# Altium schematic sheet Transceiver.SchDoc
size 209 x 297 mm; SheetNumber: 1; SheetTotal: 1
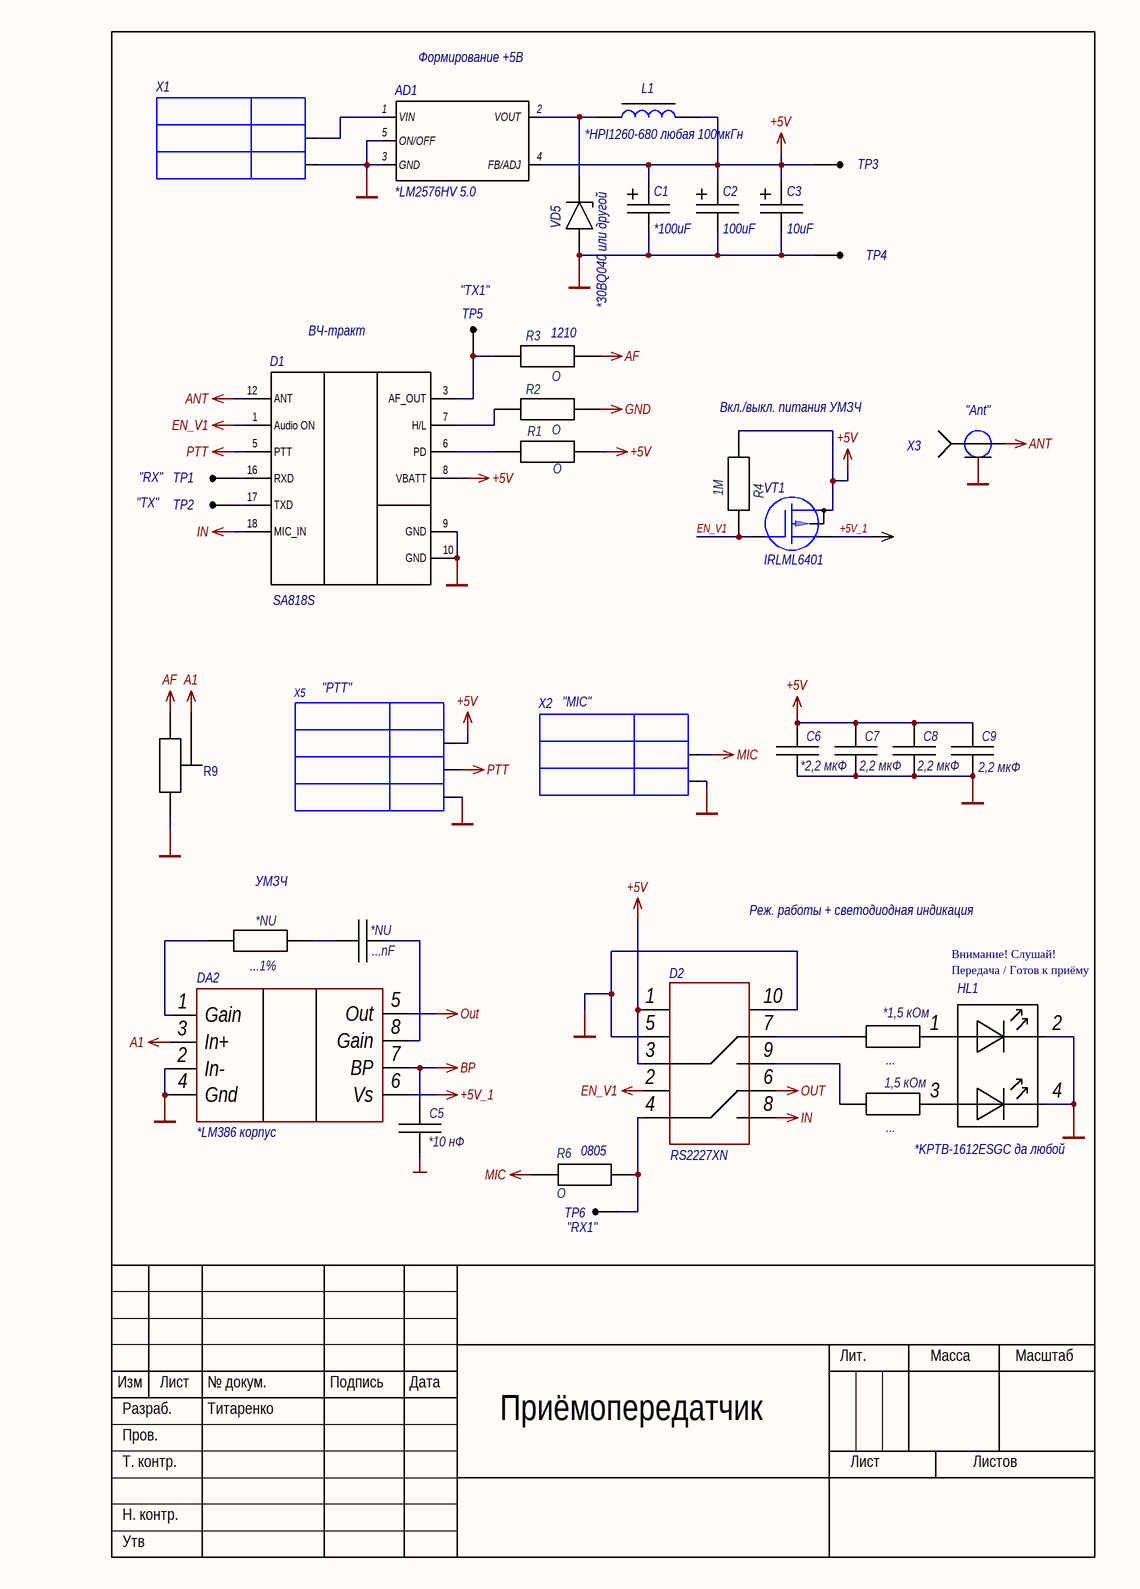
[diagram p0: Transceiver.SchDoc]

## Parts
(Parts that share a designator on the sheet are numbered #1, #2 ... from top to bottom, then left to right.)
1,5_кОм  ...  [RES_0603]
*1,5_кОм  ...  [RES_0603]
*NU#1  ...1%  [RES_0603]
*NU#2  ...nF  [CAP_0603]
AD1  *LM2576HV 5.0  [KTT0005B]
Arrow?  Arrow  [Arrow]  (value not drawn)  (graphical)
C1  value *100uF  [POSCAP_D12_D15_D15E_D2E_D2_D3L_D4]  (hidden comment: 10TPB330M 10V 330uF  ±20%)
C2  value 100uF  [CAPPM7343X310N]  (hidden comment: 6V 220 uF CASE D)
C3  value 10uF  [CAPPM6032X280N]  (hidden comment: 10V 100uF CASE C)
C5  *10 нФ  [CAP_0603]
C6  *2,2 мкФ  [CAP_0603]
C7  2,2 мкФ  [CAP_0603]
C8  2,2 мкФ  [CAP_0603]
C9  2,2 мкФ  [CAP_0603]
D1  SA818S  [SA818S]
D2  RS2227XN  [*SOP50P490X110-10N]
DA2  *LM386 корпус  [LM386]
HL1  *KPTB-1612ESGC да любой  [KPTB1612ESGC]
L1  *HPI1260-680 любая 100мкГн  [HPI1260101]
R1  О  [RES_0603]
R2  О  [RES_0603]
R3  О  [RES_0603]
R4  1M  [RES_0603]
R6  О  [RES_0603]
R9  3266W-1-103  [3266W1103]  (value not drawn)
TP1  Тестовый контакт  [TP1]  (value not drawn)  (no BOM)
TP2  Тестовый контакт  [TP1]  (value not drawn)  (no BOM)
TP3  Тестовый контакт  [TP1]  (value not drawn)  (no BOM)
TP4  Тестовый контакт  [TP1]  (value not drawn)  (no BOM)
TP5  Тестовый контакт  [TP1]  (value not drawn)  (no BOM)
TP6  Тестовый контакт  [TP1]  (value not drawn)  (no BOM)
VD5  *30BQ040 или другой  [DIOM7959X262N]
VT1  IRLML6401  [IRLML6401]
X1  B2B-PH-K-S (LF)(SN)  [B2BPHKSLFSN]  (value not drawn)
X2  Connector  [PLL1.27-2]  (value not drawn)
X3  SMA-JR  [HUBER-SUHNER_85 SMA-50-0-101/111 NE]  (value not drawn)
X5  Connector  [1,27-1X3_straight]  (value not drawn)

## Nets
+5V: AD1.4(FB/ADJ) C1.1 C2.1 C3.1 C6.1 C7.1 C8.1 C9.1 D1.8(VBATT) D2.1 D2.3 L1.2 R1.1 R4.2 TP3.1 VT1.2 X5.1
+5V_1: Arrow?.6 DA2.6(Vs) VT1.3
A1: DA2.3(In+) R9.2
AF: R3.1 R9.3
ANT: D1.12(ANT) X3.1
BP: C5.1 DA2.7(BP)
EN_V1: D1.1(Audio_ON) D2.2 R4.1 VT1.1
GND: AD1.3(GND) AD1.5(ON/OFF) AD1.6(GND) C1.2 C2.2 C3.2 C5.2 C6.2 C7.2 C8.2 C9.2 D1.9(GND) D1.10(GND) D2.5 D2.10 DA2.2(In-) DA2.4(Gnd) HL1.2 HL1.4 R2.1 R9.1 TP4.1 VD5.A X1.2 X2.2 X3.2 X3.3 X3.4 X3.5 X5.3
IN: D1.18(MIC_IN) D2.8
MIC: R6.2 X2.1
Out: D2.6 DA2.5(Out)
PTT: D1.5(PTT) X5.2
Net1,5_кОм_1: 1,5_кОм.1 D2.9
Net1,5_кОм_2: 1,5_кОм.2 HL1.3
Net*1,5_кОм_1: *1,5_кОм.1 D2.7
Net*1,5_кОм_2: *1,5_кОм.2 HL1.1
Net*NU#1_1: *NU#1.1 *NU#2.1
Net*NU#1_2: *NU#1.2 DA2.1(Gain)
Net*NU#2_2: *NU#2.2 DA2.8(Gain)
NetAD1_1: AD1.1(VIN) X1.1
NetAD1_2: AD1.2(VOUT) L1.1 VD5.K
NetD1_3: D1.3(AF_OUT) R3.2 TP5.1
NetD1_6: D1.6(PD) R1.2
NetD1_7: D1.7(H/L) R2.2
NetD1_16: D1.16(RXD) TP1.1
NetD1_17: D1.17(TXD) TP2.1
NetD2_4: D2.4 R6.1 TP6.1

Not connected (* = marked no-connect by the designer): D1 2(N/C) 4(N/C) 11(N/C) 13(N/C) 14(N/C) 15(N/C)

## Notes on the sheet
- (near AD1) Формирование +5В
- (near TP5) "TX1"
- ВЧ-тракт
- (near R3) 1210
- (near R4) Вкл./выкл. питания УМЗЧ
- (near X3) "Ant"
- "TX"
- "RX"
- "PTT"
- "MIC"
- (near *NU#1) УМЗЧ
- Реж. работы + светодиодная индикация
- Внимание! Слушай!
- Передача / Готов к приёму
- (near R6) 0805
- (near TP6) "RX1"
- Изм
- Лист
- № докум.
- Подпись
- Дата
- Лит.
- Масса
- Масштаб
- Разраб.
- Пров.
- Т. контр.
- Титаренко
- Приёмопередатчик
- Листов
- Н. контр.
- Утв

## Library data of the parts
1,5_кОм *1,5_кОм *NU#1 = R_150K 1%
*NU#2 C5-C9 = CAP 0.1uF
AD1 = LM2576HVR
C1-C3 = Конденсатор B41851F7228M000: Manufacturer: АЖЯР.67354.007ТУ; Power/Voltage: "D" - 16В; Rem: К53-68; Tolerance: +-5%; Family: Конденсатор
D2 = Component_1
DA2 = LM386
HL1 = BL-BEG204
L1 = Дроссель ДПМ-2,4-20
R1-R4 R6 = R_1k
R9 = R_podstr: #Part number: RC0402JR-1010KL; #Value: 10 кОм; TY: ТУ; #Power: Мощность; #Tolerance: ±5%; #Type_1: 0402; #Vendor: "Yageo"; #(: (; #): ); #PlacementTolerance: ""
VD5 = SS34
X1 = Connector
TP1-TP6 = Тестовый контакт: Value: *